# EAGLE design uc_relay (EAGLE 6.3)
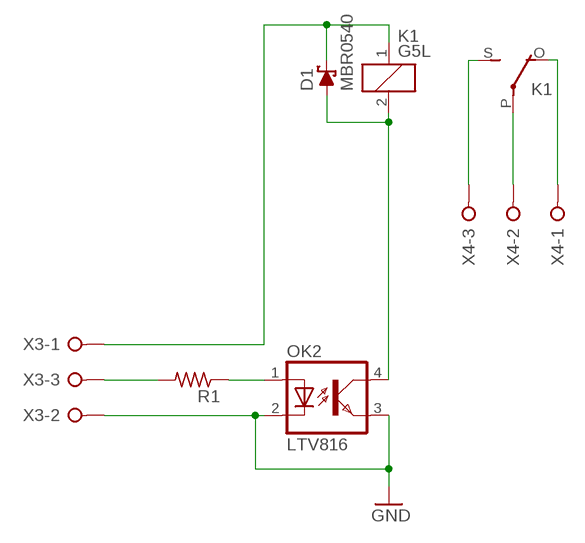
[diagram p0: schematic, sheet 1]

## Parts
D1  MBR0540  [SOD123]
K1  G5L  [G5LE]
OK2  LTV816  [DIL04]
R1  R-US_R0805  [R0805]
X3  W237-3E  [W237-3E]
X4  W237-3E  [W237-3E]

## Nets
GND: OK2.2(C) OK2.3(EMIT) X3.2
N$1: K1.S(2:S) X4.3
N$2: K1.P(2:P) X4.2
N$3: K1.O(2:O) X4.1
N$4: R1.2 X3.3
N$6: OK2.1(A) R1.1
N$7: D1.C K1.1 X3.1
N$35: D1.A K1.2 OK2.4(COL)

## Library data of the parts
D1 = diode:MBR0540: schottky diode, 0.5A, 40V ON Semiconductor
K1 = relay:G5L: RELAY 1 x switch, 10 A/120 V AC, 8 A/30 V ADC, Omron
OK2 = optocoupler:LTV816: OPTO COUPLER Source: LITEON, LTV816.pdf; OC_FARNELL: unknown; OC_NEWARK: unknown
R1 = resistor:R-US_: RESISTOR, American symbol
X3 X4 = con-wago-508:W237-3E: WAGO SREW CLAMP; OC_FARNELL: unknown; OC_NEWARK: unknown

## Net classes
0 default: width 0.152 mm, drill 0.305 mm, clearance 0.152 mm

## Board
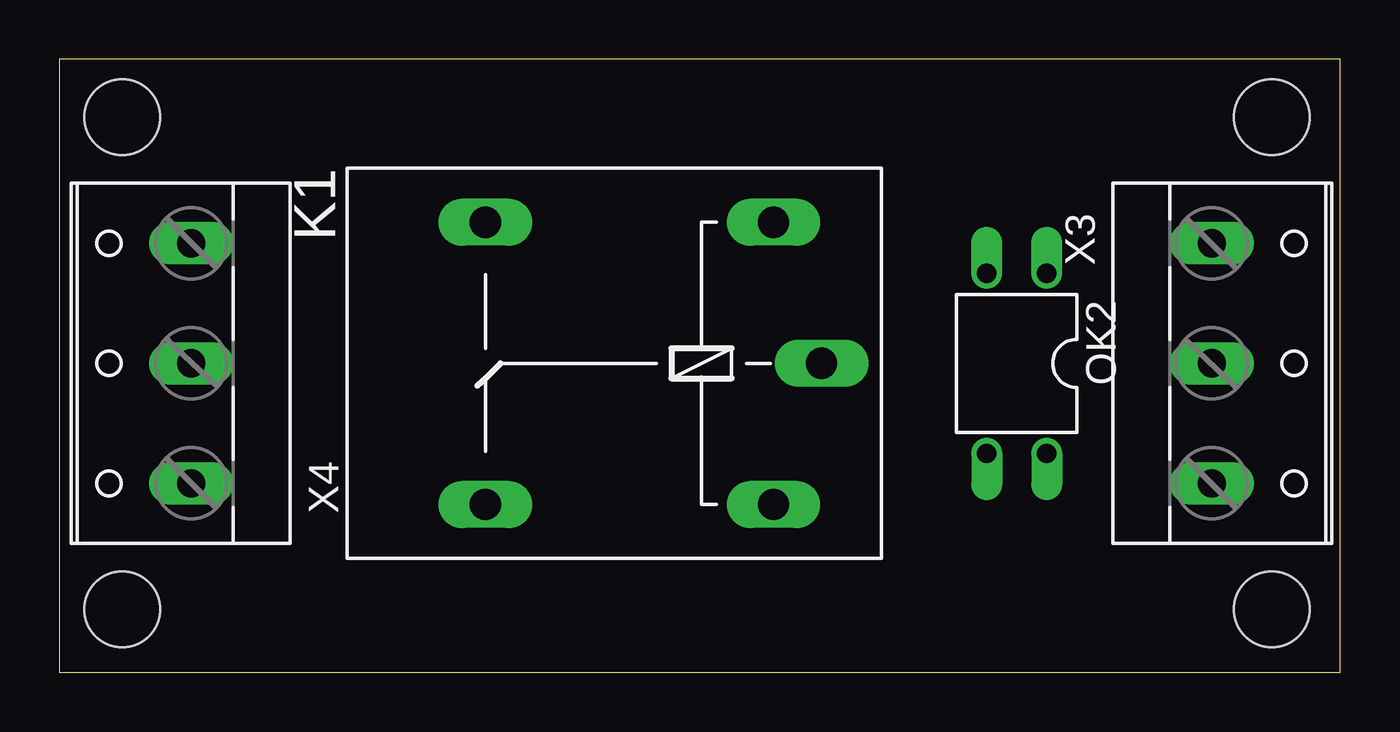
[diagram p1: board, top side]
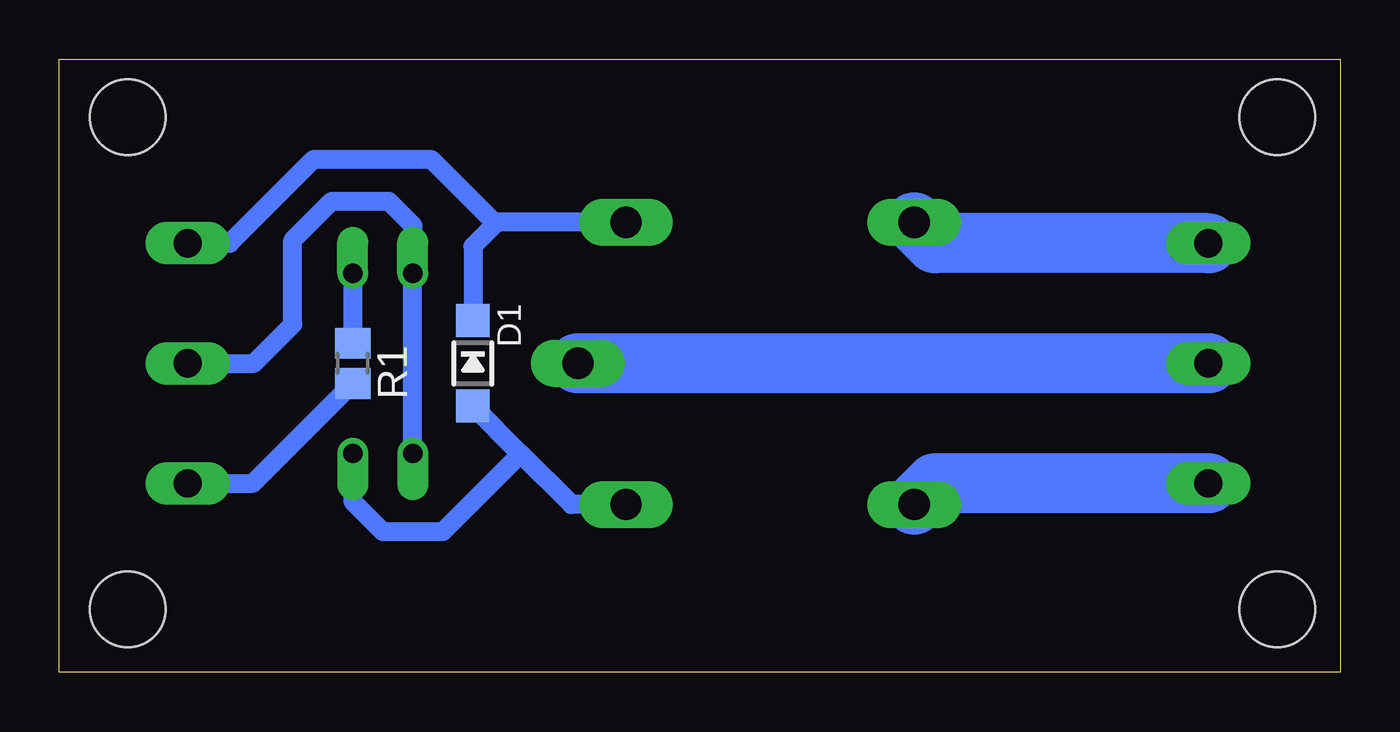
[diagram p2: board, bottom side, seen from below]

Size 54.21 x 25.96 mm. Coordinates in mm from the lower left corner, seen from the top.
Outline: 0,0 54.21,0 54.21,25.96 0,25.96 0,0
Copper layers (1*16): Top 0.035mm / dielectric 1.5mm / Bottom 0.035mm
Design rules "default": minimum track width 10mil, minimum drill 24mil, track to track 8mil, track to pad 8mil, pad to pad 8mil, via to via 8mil, smd to smd 8mil, copper to edge 40mil, drill to drill 8mil, minimum pad ring 10mil, minimum via ring 8mil, stop-mask expansion 4mil, vias tented up to drill 0mil, thermal gap 10mil
Holes 3.2 mm at 2.67,2.67 51.31,2.67 51.31,23.5 2.67,23.5

### Footprints (pad centres in the part's own frame; a part is rotated, then mirrored left to right if it is on the bottom)
SOD123 = smd 1.4 x 1.4: A 1.805,0; C -1.805,0
G5LE = drill 1.321 long: 1 -7.493,-5.969; 2 -7.493,5.969; O 4.699,5.969; P -9.525,0; S 4.699,-5.969
DIL04 = drill 0.813 offset: 1 -1.27,-3.81; 2 1.27,-3.81; 3 1.27,3.81; 4 -1.27,3.81
R0805 = smd 1.3 x 1.5: 1 -0.85,0; 2 0.85,0
W237-3E = drill 1.194 long: 1 -5.08,-0.635; 2 0,-0.635; 3 5.08,-0.635

### Placement (x,y rotation side)
D1  36.7,13.08 270 bottom
K1  22.73,13.08 180 top
OK2  40.51,13.08 180 top
R1  41.78,13.08 270 bottom
X3  49.4,13.08 270 top
X4  4.95,13.08 90 top

### Tracks (layer width: path | path; a pad name or v marks a point on that pad's centre or on a via)
GND
  Bottom 0.813: OK2.3 OK2.2 39.24,18.92 40.26,19.94 42.67,19.94 44.32,18.29 44.32,14.73 45.97,13.08 X3.2
N$1
  Bottom 2.54: X4.3 17.14,18.16 K1.S
N$2
  Bottom 2.54: X4.2 K1.P
N$3
  Bottom 2.54: X4.1 17.14,8 K1.O
N$4
  Bottom 0.813: X3.3 46.01,8 R1.2
N$6
  Bottom 0.813: OK2.1 R1.1
N$7
  Bottom 0.813: K1.1 35.69,19.05 35.75,18.99 | 35.75,18.99 36.7,18.03 D1.C | X3.1 46.99,18.16 43.43,21.72 38.48,21.72 35.75,18.99
N$35
  Bottom 0.813: K1.2 32.54,7.11 34.68,9.26 | 34.68,9.26 D1.A | OK2.4 41.78,7.24 40.51,5.97 37.97,5.97 34.68,9.26